# Altium project GARY_MIDI_CV_Converter.PrjPcb
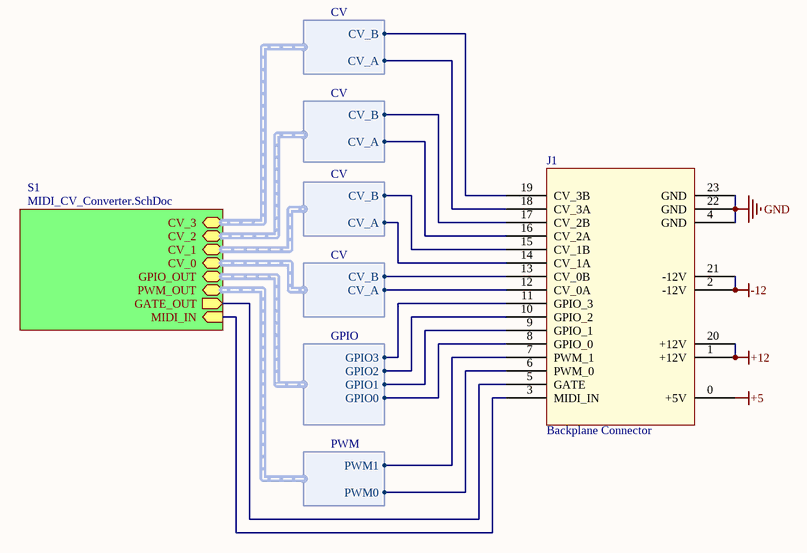
[diagram p0: Top Sheet.SchDoc]
4 sheets, 87 parts. Net scope: hierarchical (ports join the sheet entries above them; power ports are global).
Board file: GARY_MIDI_CV_Converter.PcbDoc
Sheets:
  Top Sheet.SchDoc
    S1 = MIDI_CV_Converter.SchDoc
      Current Buffer = CV_GATE_Current_Buffer.SchDoc
      Digital-Analog Converter_0 = DAC.SchDoc
      Digital-Analog Converter_1 = DAC.SchDoc
      Digital-Analog Converter_2 = DAC.SchDoc
      Digital-Analog Converter_3 = DAC.SchDoc

## Sheet Top Sheet.SchDoc: MIDI-CV Converter: Backplane Connector
size Letter; Engineer: Nicholas Morrow; DocumentNumber: 1; SheetNumber: 1; SheetTotal: 5; Project: GARY Synthesizer

### Parts
J1  Backplane Connector  [MIDI-CV CONVERTER MODULE]

### Sub-sheets
S1 = MIDI_CV_Converter.SchDoc: MIDI_IN (in), CV_0 (harness CV), CV_1 (harness CV), CV_2 (harness CV), CV_3 (harness CV), PWM_OUT (harness PWM), GPIO_OUT (harness GPIO), GATE_OUT (out)

### Harnesses
CV: CV_B, CV_A
PWM: PWM0, PWM1
GPIO: GPIO0, GPIO1, GPIO2, GPIO3

### Nets
+5: J1.0(+5V)
+12: J1.1(+12V) J1.20(+12V)
-12: J1.2(-12V) J1.21(-12V)
GND: J1.4(GND) J1.22(GND) J1.23(GND)
NetD1_2: J1.12(CV_0A) ; sheet S1/CV_0.CV_A
NetD2_2: J1.13(CV_0B) ; sheet S1/CV_0.CV_B
NetD3#2_2: J1.14(CV_1A) ; sheet S1/CV_1.CV_A
NetD4_2: J1.15(CV_1B) ; sheet S1/CV_1.CV_B
NetD5_2: J1.16(CV_2A) ; sheet S1/CV_2.CV_A
NetD6_2: J1.17(CV_2B) ; sheet S1/CV_2.CV_B
NetD7_2: J1.18(CV_3A) ; sheet S1/CV_3.CV_A
NetD8_2: J1.19(CV_3B) ; sheet S1/CV_3.CV_B
NetJ1_3: J1.3(MIDI_IN) ; sheet S1/MIDI_IN
NetJ1_5: J1.5(GATE) ; sheet S1/GATE_OUT
NetJ1_6: J1.6(PWM_0) ; sheet S1/PWM_OUT.PWM0
NetJ1_7: J1.7(PWM_1) ; sheet S1/PWM_OUT.PWM1
NetJ1_8: J1.8(GPIO_0) ; sheet S1/GPIO_OUT.GPIO0
NetJ1_9: J1.9(GPIO_1) ; sheet S1/GPIO_OUT.GPIO1
NetJ1_10: J1.10(GPIO_2) ; sheet S1/GPIO_OUT.GPIO2
NetJ1_11: J1.11(GPIO_3) ; sheet S1/GPIO_OUT.GPIO3

### Notes on the sheet
- Notes:
- Title:
- Size:
- Project:
- Letter
- Number:
- Revision:
- Date:
- Engineer:
- Sheet:
- of

### Library data of the parts
J1 = MIDI_CV_Converter

## Sheet MIDI_CV_Converter.SchDoc: MIDI-CV Converter
size Letter; DrawnBy: Nicholas Morrow; Engineer: Nicholas Morrow; Organization: Nicholas Morrow; Address1: UC Santa Barbara; Address2: Physics 127AL; Address3: Spring 2015; DocumentNumber: 4; Revision: a; SheetNumber: 4; SheetTotal: 5; Project: GARY Synthesizer
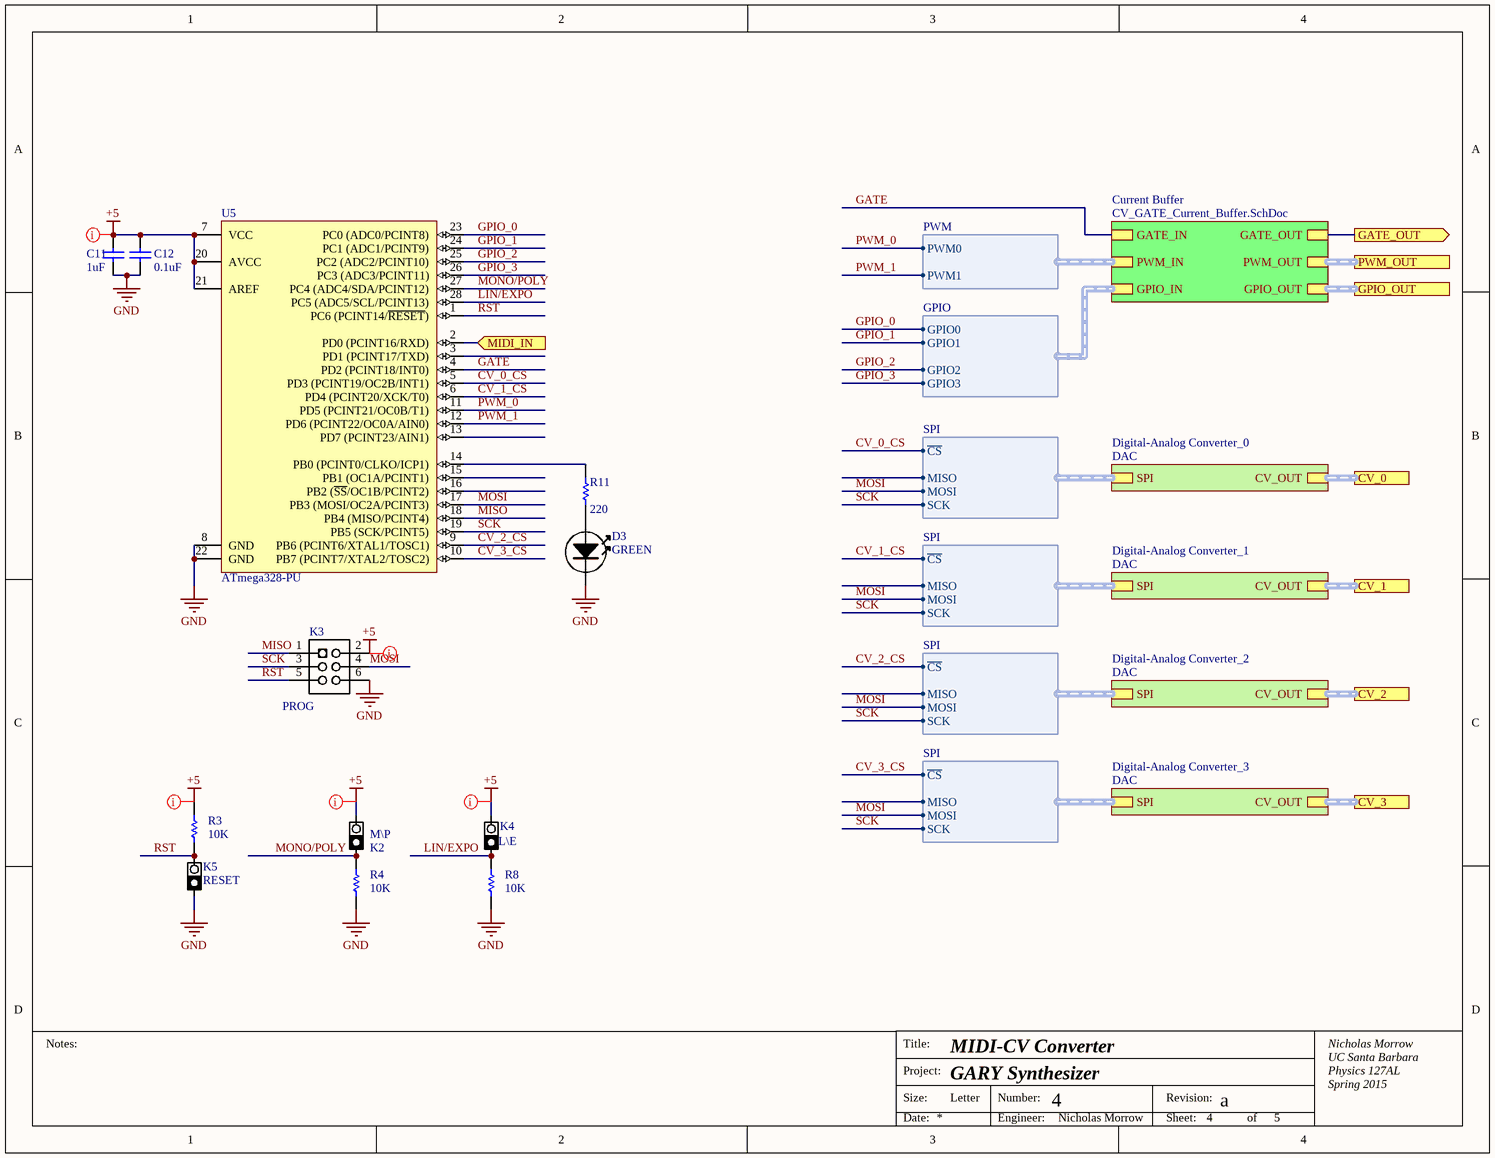
[diagram p1: MIDI_CV_Converter.SchDoc]

### Parts
(Parts that share a designator on the sheet are numbered #1, #2 ... from top to bottom, then left to right.)
C11#1  value 1uF  [CAP 5X11]  (hidden comment: Cap)
C12#1  value 0.1uF  [CAP 5X11]  (hidden comment: Cap)
D3#1  GREEN  [LED-5MM-GREEN]
K2#1  M\P  [JMPR2]
K3#1  PROG  [HEADER-2X3]
K4#1  L\E  [JMPR2]
K5  RESET  [JMPR2]
R3#1  value 10K  [AXIAL-0.3]
R4#1  value 10K  [AXIAL-0.3]
R8#1  value 10K  [AXIAL-0.3]
R11#1  value 220  [AXIAL-0.3]
U5#1  ATmega328-PU  [28P3]

### Sub-sheets
Current Buffer = CV_GATE_Current_Buffer.SchDoc: GATE_IN, PWM_IN (harness PWM), GPIO_IN (harness GPIO), GATE_OUT, PWM_OUT (harness PWM), GPIO_OUT (harness GPIO)
Digital-Analog Converter_0 = DAC: CV_OUT (harness CV), SPI (harness SPI)
Digital-Analog Converter_1 = DAC: CV_OUT (harness CV), SPI (harness SPI)
Digital-Analog Converter_2 = DAC: CV_OUT (harness CV), SPI (harness SPI)
Digital-Analog Converter_3 = DAC: CV_OUT (harness CV), SPI (harness SPI)

### Ports
CV_0 (harness CV), CV_1 (harness CV), CV_2 (harness CV), CV_3 (harness CV), GATE_OUT (out), GPIO_OUT (harness GPIO), MIDI_IN (in), PWM_OUT (harness PWM)

### Harnesses
PWM: PWM0, PWM1
GPIO: GPIO0, GPIO1, GPIO2, GPIO3
SPI: MISO, MOSI, SCK, ~{CS}

### Nets
+5: C11#1.2 C12#1.2 K2#1.2 K3#1.2 K4#1.2 R3#1.2 U5#1.7(VCC) U5#1.20(AVCC) U5#1.21(AREF)
GND: C11#1.1 C12#1.1 D3#1.K K3#1.6 K5.1 R4#1.1 R8#1.1 U5#1.8(GND) U5#1.22(GND)
CV_0_CS: U5#1.5(PD3_(PCINT19/OC2B/INT1)) ; sheet Digital-Analog Converter_0/SPI.~{CS}  [project net CHIP_SEL]
CV_1_CS: U5#1.6(PD4_(PCINT20/XCK/T0)) ; sheet Digital-Analog Converter_1/SPI.~{CS}  [project net CHIP_SEL]
CV_2_CS: U5#1.9(PB6_(PCINT6/XTAL1/TOSC1)) ; sheet Digital-Analog Converter_2/SPI.~{CS}  [project net CHIP_SEL]
CV_3_CS: U5#1.10(PB7_(PCINT7/XTAL2/TOSC2)) ; sheet Digital-Analog Converter_3/SPI.~{CS}  [project net CHIP_SEL]
GATE: U5#1.4(PD2_(PCINT18/INT0)) ; sheet Current Buffer/GATE_IN
GPIO_0: U5#1.23(PC0_(ADC0/PCINT8)) ; sheet Current Buffer/GPIO_IN.GPIO0
GPIO_1: U5#1.24(PC1_(ADC1/PCINT9)) ; sheet Current Buffer/GPIO_IN.GPIO1
GPIO_2: U5#1.25(PC2_(ADC2/PCINT10)) ; sheet Current Buffer/GPIO_IN.GPIO2
GPIO_3: U5#1.26(PC3_(ADC3/PCINT11)) ; sheet Current Buffer/GPIO_IN.GPIO3
LIN/EXPO: K4#1.1 R8#1.2 U5#1.28(PC5_(ADC5/SCL/PCINT13))
MISO: K3#1.1 U5#1.18(PB4_(MISO/PCINT4))
MONO/POLY: K2#1.1 R4#1.2 U5#1.27(PC4_(ADC4/SDA/PCINT12))
MOSI: K3#1.4 U5#1.17(PB3_(MOSI/OC2A/PCINT3)) ; sheet Digital-Analog Converter_0/SPI.MOSI, sheet Digital-Analog Converter_1/SPI.MOSI, sheet Digital-Analog Converter_2/SPI.MOSI, sheet Digital-Analog Converter_3/SPI.MOSI
PWM_0: U5#1.11(PD5_(PCINT21/OC0B/T1)) ; sheet Current Buffer/PWM_IN.PWM0
PWM_1: U5#1.12(PD6_(PCINT22/OC0A/AIN0)) ; sheet Current Buffer/PWM_IN.PWM1
RST: K3#1.5 K5.2 R3#1.1 U5#1.1(PC6_(PCINT14/~{RESET}))
SCK: K3#1.3 U5#1.19(PB5_(SCK/PCINT5)) ; sheet Digital-Analog Converter_0/SPI.SCK, sheet Digital-Analog Converter_1/SPI.SCK, sheet Digital-Analog Converter_2/SPI.SCK, sheet Digital-Analog Converter_3/SPI.SCK
NetD3#1_A: D3#1.A R11#1.1
NetJ1_3: U5#1.2(PD0_(PCINT16/RXD)) ; port MIDI_IN
NetJ1_5: port GATE_OUT, sheet Current Buffer/GATE_OUT
NetR11#1_2: R11#1.2 U5#1.14(PB0_(PCINT0/CLKO/ICP1))

Not connected (* = marked no-connect by the designer): U5#1 3(PD1_(PCINT17/TXD)) 13(PD7_(PCINT23/AIN1)) 15(PB1_(OC1A/PCINT1)) 16(PB2_(~{SS}/OC1B/PCINT2))

### Buses and harness runs
harness port CV_0 = sheet Digital-Analog Converter_0/CV_OUT
harness port CV_1 = sheet Digital-Analog Converter_1/CV_OUT
harness port CV_2 = sheet Digital-Analog Converter_2/CV_OUT
harness port CV_3 = sheet Digital-Analog Converter_3/CV_OUT
harness port GPIO_OUT = sheet Current Buffer/GPIO_OUT
harness port PWM_OUT = sheet Current Buffer/PWM_OUT

### Layout directives
net class Power: +5

### Notes on the sheet
- Notes:
- Title:
- Size:
- Project:
- Letter
- Number:
- Revision:
- Date:
- Engineer:
- Sheet:
- of

### Library data of the parts
C11#1 C12#1 = Cap: Capacitor; Published: 8-Jun-2000; LatestRevisionDate: 17-Jul-2002; LatestRevisionNote: Re-released for DXP Platform.; PackageReference: RAD-0.3; Publisher: Altium Limited; PackageDescription: Radial Cap, Thru-Hole; 2 Leads; 0.3 in Pin Spacing
D3#1 = LED-GREEN-5MM
K2#1 K4#1 K5 = JMPR2: JMPR2 OPEN BY DEFAULT; Manufacturer: Sullins Connector Solutions; Manufacturer Part Number: PBC36SAAN; Supplier 1: Digi-Key; Supplier Part Number 1: S1011E-36-ND; Reel: Open
K3#1 = HEADER-2X3
R3#1 R4#1 R8#1 R11#1 = Res1: Resistor; Published: 8-Jun-2000; LatestRevisionDate: 17-Jul-2002; LatestRevisionNote: Re-released for DXP Platform.; PackageReference: AXIAL-0.3; Publisher: Altium Limited; PackageDescription: Axial Device, Thru-Hole; 2 Leads; 0.3 in Pin Spacing
U5#1 = ATmega328-PU: 8-bit AVR Microcontroller, 32KB Flash, 1KB EEPROM, 2KB SRAM, 28-pin PDIP, Industrial Grade (-40°C to 85°C); Published: 1-Apr-2010; DatasheetVersion: revA, Jan-2010; PackageVersion: revB, Sep-2001; PackageReference: 28P3; Publisher: Altium Limited; PackageDescription: 28-lead (0.300"/7.62mm Wide) Plastic Dual Inline Package (PDIP); Supplier 1: Digi-Key; Supplier Part Number 1: ATMEGA328-PU-ND; Supplier 2: Mouser; Supplier Part Number 2: 556-ATMEGA328-PU; ComponentLink1Description: Manufacturer Link; ComponentLink1URL: http://www.atmel.com/products/avr/default.asp?; ComponentLink2Description: ATmega48A/48PA/88A/88PA/168A/168PA/328/328P Datasheet; ComponentLink2URL: http://www.atmel.com/dyn/resources/prod_documents/8271.pdf; ComponentLink3Description: ATmega48A/48PA/88A/88PA/168A/168PA/328/328P Summary; ComponentLink3URL: http://www.atmel.com/dyn/resources/prod_documents/8271S.pdf; ComponentLink4Description: Atmel.com Home; ComponentLink4URL: http://www.atmel.com

## Sheet CV_GATE_Current_Buffer.SchDoc: MIDI-CV Converter: GPIO Buffers
size Letter; Engineer: Nicholas Morrow; DocumentNumber: 2; SheetNumber: 2; SheetTotal: 5; Project: GARY Synthesizer
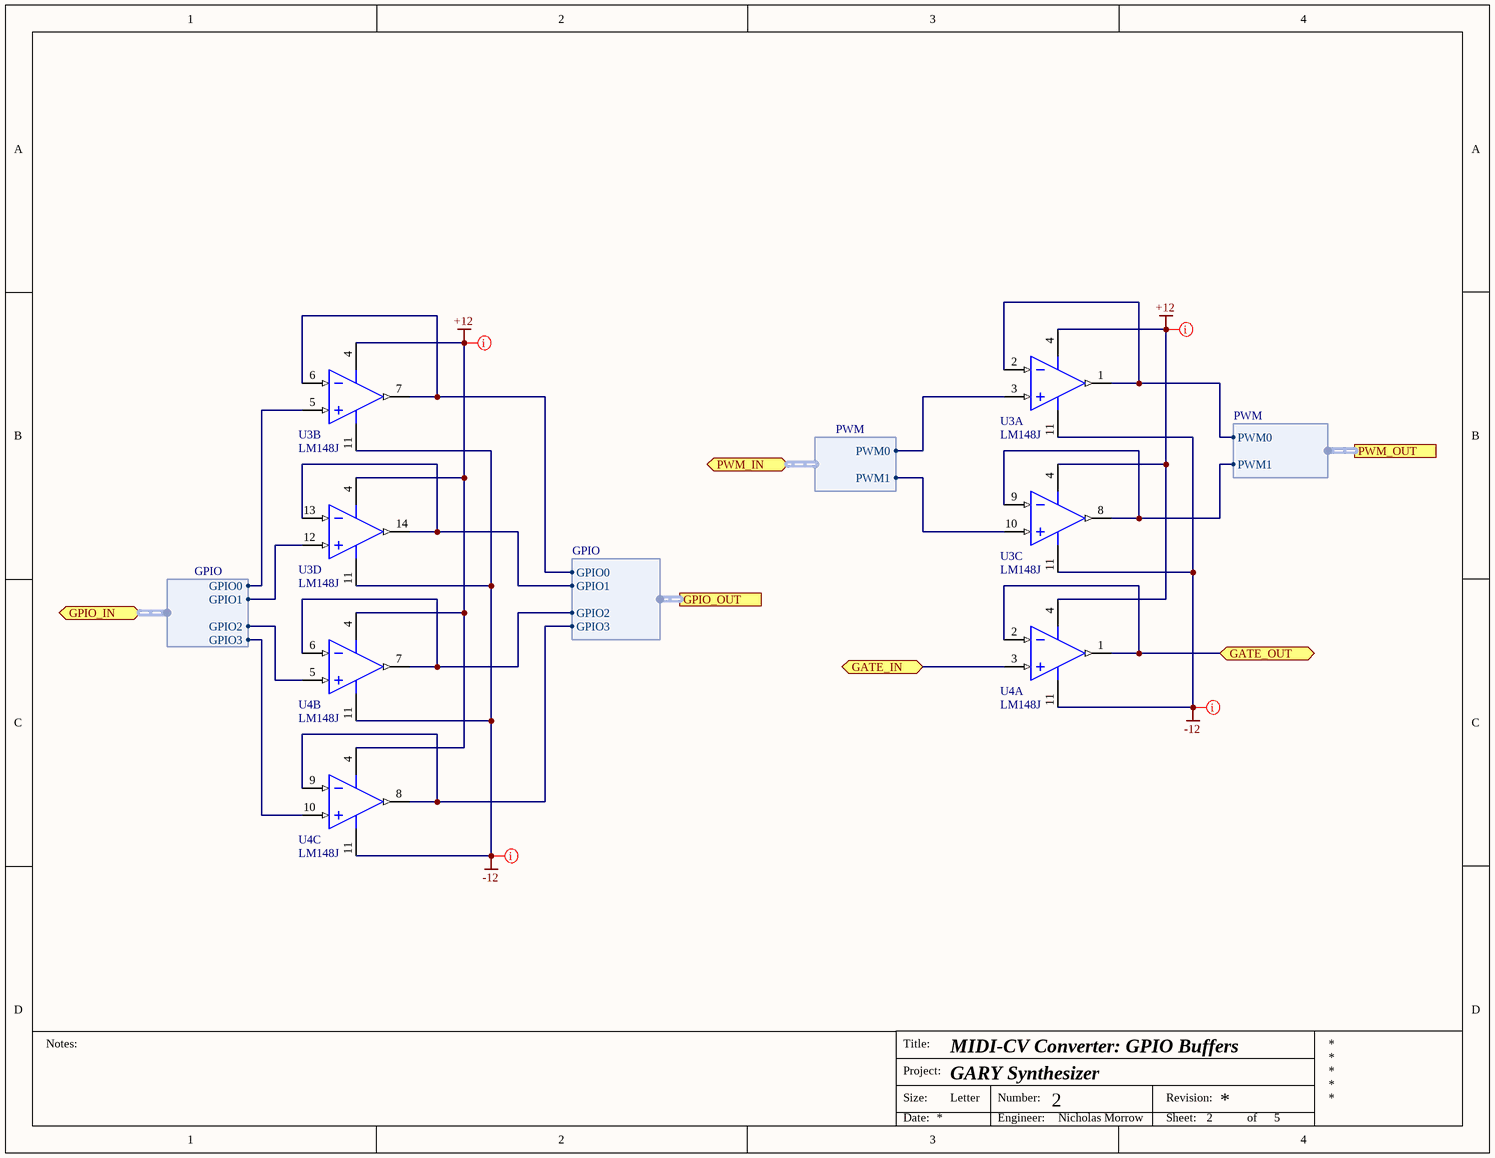
[diagram p2: CV_GATE_Current_Buffer.SchDoc]

### Parts
(Parts that share a designator on the sheet are numbered #1, #2 ... from top to bottom, then left to right.)
U3#1  LM148J  [J14A]  (parts A,B,C,D of 4)
U4#1  LM148J  [J14A]  (parts A,B,C of 4)

### Ports
GATE_IN, GATE_OUT, GPIO_IN (harness GPIO), GPIO_OUT (harness GPIO), PWM_IN (harness PWM), PWM_OUT (harness PWM)

### Harnesses
PWM: PWM0, PWM1
GPIO: GPIO0, GPIO1, GPIO2, GPIO3

### Nets
+12: U3#1.4(V+) U4#1.4(V+)
-12: U3#1.11(V-) U4#1.11(V-)
GATE: U4#1.3(IN1+) ; port GATE_IN
GPIO_0: U3#1.5(IN2+) ; port GPIO_IN.GPIO0
GPIO_1: U3#1.12(IN4+) ; port GPIO_IN.GPIO1
GPIO_2: U4#1.5(IN2+) ; port GPIO_IN.GPIO2
GPIO_3: U4#1.10(IN3+) ; port GPIO_IN.GPIO3
PWM_0: U3#1.3(IN1+) ; port PWM_IN.PWM0
PWM_1: U3#1.10(IN3+) ; port PWM_IN.PWM1
NetJ1_5: U4#1.1(OUT1) U4#1.2(IN1-) ; port GATE_OUT
NetJ1_6: U3#1.1(OUT1) U3#1.2(IN1-) ; port PWM_OUT.PWM0
NetJ1_7: U3#1.8(OUT3) U3#1.9(IN3-) ; port PWM_OUT.PWM1
NetJ1_8: U3#1.6(IN2-) U3#1.7(OUT2) ; port GPIO_OUT.GPIO0
NetJ1_9: U3#1.13(IN4-) U3#1.14(OUT4) ; port GPIO_OUT.GPIO1
NetJ1_10: U4#1.6(IN2-) U4#1.7(OUT2) ; port GPIO_OUT.GPIO2
NetJ1_11: U4#1.8(OUT3) U4#1.9(IN3-) ; port GPIO_OUT.GPIO3

### Layout directives
net class Power: +12, -12

### Notes on the sheet
- Notes:
- Title:
- Size:
- Project:
- Letter
- Number:
- Revision:
- Date:
- Engineer:
- Sheet:
- of

### Library data of the parts
U3#1 U4#1 = LM148J: Series Quad 741 Op Amp, 14-pin CerDIP; Manufacturer: National Semiconductor; PackageTopMarking: NSUZXYYTT*LM148J; PowerWise: N; CompType: Amplifiers; High-Reliability: Y; DatasheetVersion: Nov-2003; PackageVersion: revJ, Jul-2002; PackageReference: J14A; PackageDescription: Cerdip, .400 x .310in Body, 14 Lead, .300in Centers, .100in Pitch; PartNumber: LM148J; RoHS: N; PinCount: 14; ComponentLink1Description: Manufacturer URL; ComponentLink1URL: http://www.national.com/; ComponentLink2Description: LM148 Datasheet; ComponentLink2URL: http://www.national.com/ds/LM/LM148.pdf; ComponentLink3Description: LM148 Web Page; ComponentLink3URL: http://www.national.com/pf/LM/LM148.html; ComponentLink4Description: J14A Package Page; ComponentLink4URL: http://www.national.com/packaging/folders/j14a.html

## Sheet DAC.SchDoc: MIDI-CV Converter: D-A Converter
size Letter; Engineer: Nicholas Morrow; DocumentNumber: 3; SheetNumber: 3; SheetTotal: 5; Project: GARY Synthesizer
Used 4 times, as channels S1/Digital-Analog Converter_0, S1/Digital-Analog Converter_1, S1/Digital-Analog Converter_2, S1/Digital-Analog Converter_3. Parts and nets are listed once, with the designators drawn on the sheet.
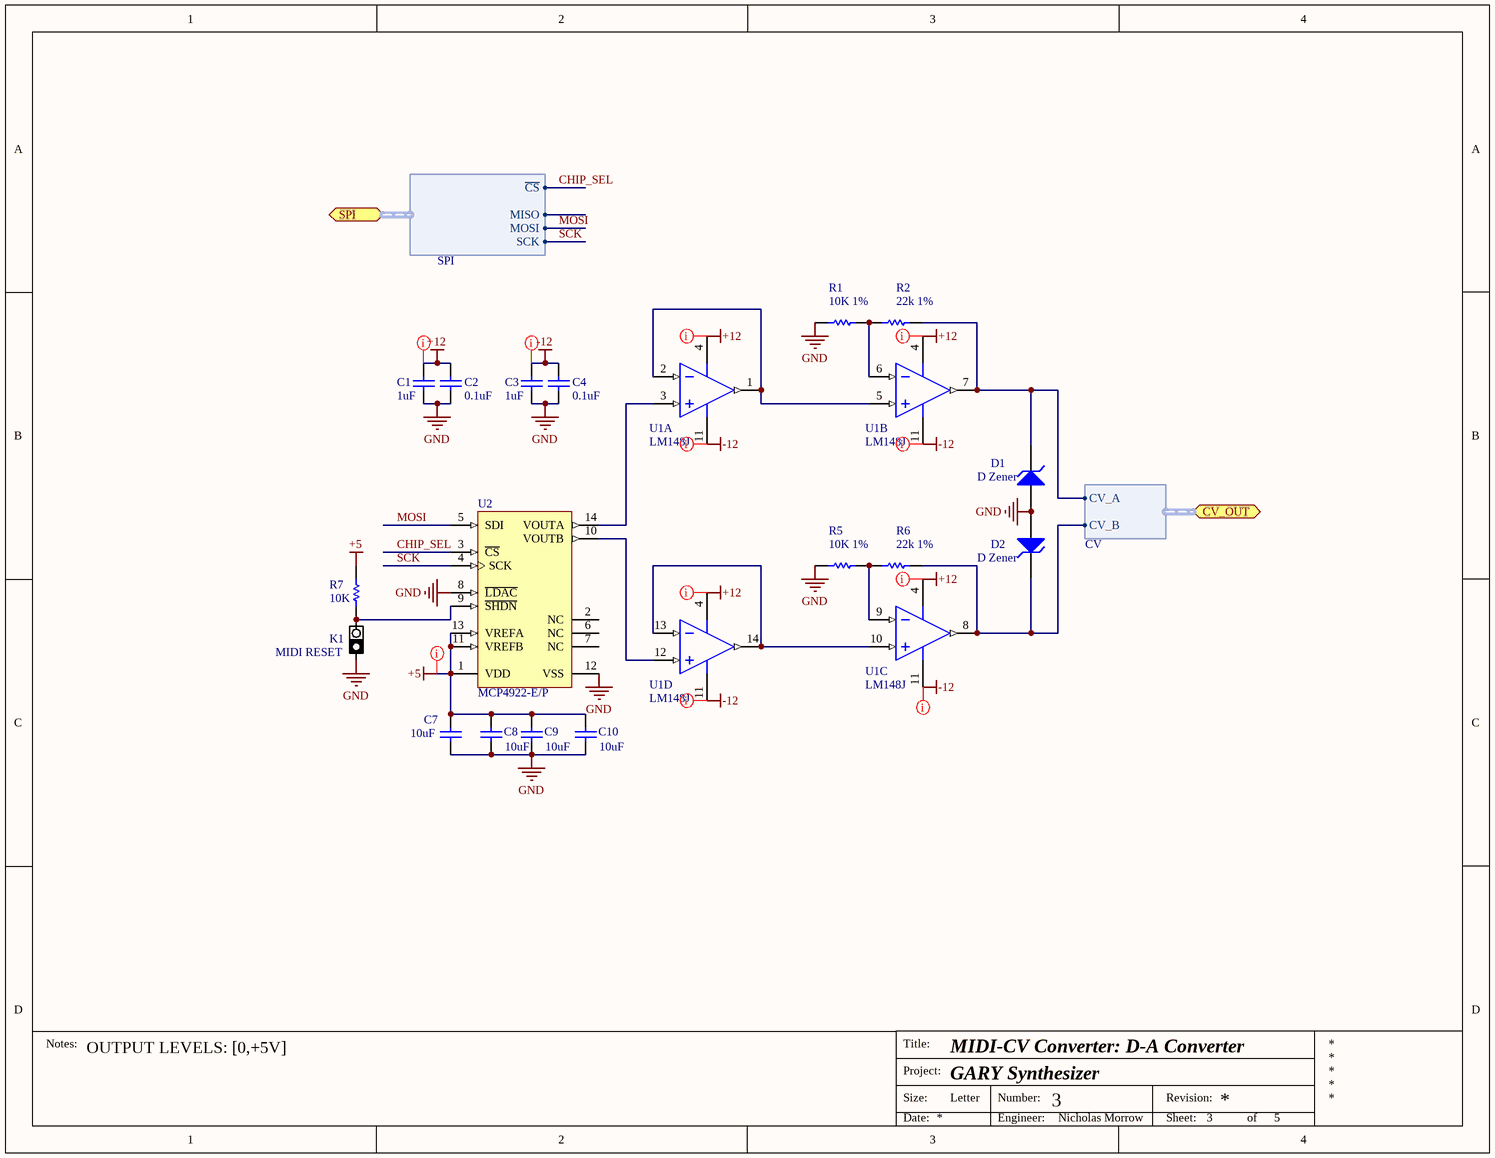
[diagram p3: DAC.SchDoc]

### Parts
C1  value 1uF  [CAP 5X11]  (hidden comment: Cap)
C2  value 0.1uF  [CAP 5X11]  (hidden comment: Cap)
C3  value 1uF  [CAP 5X11]  (hidden comment: Cap)
C4  value 0.1uF  [CAP 5X11]  (hidden comment: Cap)
C7  value 10uF  [CAP 5X11]  (hidden comment: Cap)
C8  value 10uF  [CAP 5X11]  (hidden comment: Cap)
C9  value 10uF  [CAP 5X11]  (hidden comment: Cap)
C10  value 10uF  [CAP 5X11]  (hidden comment: Cap)
D1  D Zener  [DIODE-0.4]
D2  D Zener  [DIODE-0.4]
K1  MIDI RESET  [JMPR2]
R1  value 10K 1%  [AXIAL-0.3]
R2  value 22k 1%  [AXIAL-0.3]
R5  value 10K 1%  [AXIAL-0.3]
R6  value 22k 1%  [AXIAL-0.3]
R7  value 10K  [AXIAL-0.3]
U1  LM148J  [J14A]  (parts A,B,C,D of 4)
U2  MCP4922-E/P  [PDIP300-P14]

### Ports
CV_OUT (harness CV), SPI (harness SPI)

### Harnesses
CV: CV_A, CV_B
SPI: MISO, MOSI, SCK, ~{CS}

### Nets
+5: C7.2 C8.2 C9.2 C10.2 R7.2 U2.1(VDD) U2.11(VREFB) U2.13(VREFA)
+12: C1.2 C2.2 U1.4(V+)
-12: C3.2 C4.2 U1.11(V-)
GND: C1.1 C2.1 C3.1 C4.1 C7.1 C8.1 C9.1 C10.1 D1.1(A) D2.1(A) K1.1 R1.2 R5.2 U2.8(~{LDAC}) U2.12(VSS)
CHIP_SEL: U2.3(~{CS}) ; port SPI.~{CS}
MOSI: U2.5(SDI) ; port SPI.MOSI
SCK: U2.4(SCK) ; port SPI.SCK
NetD1_2: D1.2(K) R2.1 U1.7(OUT2) ; port CV_OUT.CV_A
NetD2_2: D2.2(K) R6.1 U1.8(OUT3) ; port CV_OUT.CV_B
NetK1_2: K1.2 R7.1 U2.9(~{SHDN})
NetR1_1: R1.1 R2.2 U1.6(IN2-)
NetR5_1: R5.1 R6.2 U1.9(IN3-)
NetU1_1: U1.1(OUT1) U1.2(IN1-) U1.5(IN2+)
NetU1_3: U1.3(IN1+) U2.14(VOUTA)
NetU1_10: U1.10(IN3+) U1.13(IN4-) U1.14(OUT4)
NetU1_12: U1.12(IN4+) U2.10(VOUTB)

Not connected (* = marked no-connect by the designer): U2 2(NC) 6(NC) 7(NC)

### Channels
S1/Digital-Analog Converter_0: designators C1=C1 C2=C2 C3=C3 C4=C4 C7=C5 C8=C6 C9=C7 C10=C8 D1=D1 D2=D2 K1=K1 R1=R1 R2=R2 R5=R3#2 R6=R4#2 R7=R5 U1=U3#2 U2=U4#2
S1/Digital-Analog Converter_1: designators C1=C9 C2=C10 C3=C11#2 C4=C12#2 C7=C13 C8=C14 C9=C15 C10=C16 D1=D3#2 D2=D4 K1=K2#2 R1=R6 R2=R7 R5=R8#2 R6=R9 R7=R10 U1=U5#2 U2=U6
S1/Digital-Analog Converter_2: designators C1=C17 C2=C18 C3=C19 C4=C20 C7=C21 C8=C22 C9=C23 C10=C24 D1=D5 D2=D6 K1=K3#2 R1=R11#2 R2=R12 R5=R13 R6=R14 R7=R15 U1=U7 U2=U8
S1/Digital-Analog Converter_3: designators C1=C25 C2=C26 C3=C27 C4=C28 C7=C29 C8=C30 C9=C31 C10=C32 D1=D7 D2=D8 K1=K4#2 R1=R16 R2=R17 R5=R18 R6=R19 R7=R20 U1=U9 U2=U10

### Layout directives
net class Power: +5, +12, -12

### Notes on the sheet
- OUTPUT LEVELS: [0,+5V]
- Notes:
- Title:
- Size:
- Project:
- Letter
- Number:
- Revision:
- Date:
- Engineer:
- Sheet:
- of

### Library data of the parts
C1-C4 C7-C10 = Cap: Capacitor; Published: 8-Jun-2000; LatestRevisionDate: 17-Jul-2002; LatestRevisionNote: Re-released for DXP Platform.; PackageReference: RAD-0.3; Publisher: Altium Limited; PackageDescription: Radial Cap, Thru-Hole; 2 Leads; 0.3 in Pin Spacing
D1 D2 = D Zener: Zener Diode; Manufacturer: NXP Semiconductors; Manufacturer Part Number: NZX3V0C,133; Voltage - Zener (Nom) (Vz): 3V; Tolerance: ±3%; Power - Max: 500mW; Impedance (Max) (Zzt): 100 Ohm; Current - Reverse Leakage @ Vr: 10µA @ 1V; Voltage - Forward (Vf) (Max) @ If: 1.5V @ 200mA; Published: 8-Jun-2000; LatestRevisionDate: 17-Jul-2002; LatestRevisionNote: Re-released for DXP Platform.; PackageReference: DIODE-0.7; Publisher: Altium Limited; PackageDescription: Diode, Thru-Hole; 2 Leads; 0.7 in Pin Spacing; Supplier 1: Digi-Key; RoHS: RoHS non-compliant; Category: Discrete Semiconductor Products; Stock 1: 16581; Pricing 1: 1=0.21, 10=0.191, 25=0.174, 100=0.1251, 250=0.07372, 500=0.06116, 1000=0.04172, 2500=0.0355 (USD); Packaging: Cut Tape (CT); Operating Temperature: -55°C ~ 175°C; Mounting Type: Through Hole; Package / Case: DO-204AH, DO-35, Axial; Supplier Device Package: ALF2; ComponentLink1URL: http://www.nxp.com/documents/data_sheet/NZX_SER.pdf; ComponentLink1Description: http://www.nxp.com/documents/data_sheet/NZX_SER.pdf
K1 = JMPR2: as K2#1 on sheet MIDI_CV_Converter; Supplier 1: Digi-Key; Supplier Part Number 1: S1011E-36-ND; Reel: Open
R1 R2 R5-R7 = Res1: Resistor; Published: 8-Jun-2000; LatestRevisionDate: 17-Jul-2002; LatestRevisionNote: Re-released for DXP Platform.; PackageReference: AXIAL-0.3; Publisher: Altium Limited; PackageDescription: Axial Device, Thru-Hole; 2 Leads; 0.3 in Pin Spacing
U1 = LM148J: as U3#1 on sheet CV_GATE_Current_Buffer; DatasheetVersion: Nov-2003; PackageVersion: revJ, Jul-2002; PackageReference: J14A; PackageDescription: Cerdip, .400 x .310in Body, 14 Lead, .300in Centers, .100in Pitch; PartNumber: LM148J; RoHS: N; PinCount: 14; ComponentLink1Description: Manufacturer URL; ComponentLink1URL: http://www.national.com/; ComponentLink2Description: LM148 Datasheet; ComponentLink2URL: http://www.national.com/ds/LM/LM148.pdf; ComponentLink3Description: LM148 Web Page; ComponentLink3URL: http://www.national.com/pf/LM/LM148.html; ComponentLink4Description: J14A Package Page; ComponentLink4URL: http://www.national.com/packaging/folders/j14a.html
U2 = MCP4922-E/P: 12-Bit DAC with SPI Interface, 14-Pin PDIP, Extended Temperature; Manufacturer: Microchip; Settling Time: 4.5µs; Number of Bits: 12; Number of Converters: 2; Voltage Supply Source: Single Supply; Number of Outputs and Type: 2 Voltage, Unipolar; 2 Voltage, Bipolar; DatasheetVersion: revA, Apr-2010; PackageVersion: revBB, Aug-2009; PackageReference: PDIP300-P14; PackageDescription: 14-Lead Plastic Dual In-Line (P) - 300 mil Body [PDIP]; Supplier 1: Digi-Key; Supplier Part Number 1: MCP4922-E/P-ND; Supplier 2: Farnell; Supplier Part Number 2: 1292244; Supplier 3: Newark; Supplier Part Number 3: 61K2950; Supplier 4: Mouser; Supplier Part Number 4: 579-MCP4922-E/P; Mounting Technology: Through Hole; PartNumber: MCP4922-E/P; ComponentLink1Description: Manufacturer URL; ComponentLink1URL: http://www.microchip.com/; ComponentLink2Description: Datasheet; ComponentLink2URL: http://ww1.microchip.com/downloads/en/DeviceDoc/22250A.pdf; ComponentLink3Description: Package Specification; ComponentLink3URL: http://www.microchip.com/stellent/groups/techpub_sg/documents/packagingspec/en012702.pdf; Manufacturer Part Number: MCP4922-E/P; RoHS: RoHS Compliant; Category: Integrated Circuits (ICs); Stock 1: 1015; Pricing 1: 1=3.14, 10=2.62, 25=2.19, 100=1.99 (USD); Packaging: Tube; Data Interface: SPI; Operating Temperature: -40°C ~ 125°C; Mounting Type: Through Hole; Package / Case: 14-DIP (0.300", 7.62mm); Supplier Device Package: 14-PDIP; Sampling Rate (Per Second): *; ComponentLink4URL: http://www.microchip.com/mymicrochip/filehandler.aspx?ddocname=en547858; ComponentLink4Description: http://www.microchip.com/mymicrochip/filehandler.aspx?ddocname=en547858

## Nets that join several sheets
+5: Top Sheet (J1.0), MIDI_CV_Converter (9 pins), S1/Digital-Analog Converter_0 (8 pins), S1/Digital-Analog Converter_1 (8 pins), S1/Digital-Analog Converter_2 (8 pins), S1/Digital-Analog Converter_3 (8 pins)
+12: Top Sheet (J1.1 J1.20), CV_GATE_Current_Buffer (U3#1.4 U4#1.4), S1/Digital-Analog Converter_0 (C1.2 C2.2 U3#2.4), S1/Digital-Analog Converter_1 (C9.2 C10.2 U5#2.4), S1/Digital-Analog Converter_2 (C17.2 C18.2 U7.4), S1/Digital-Analog Converter_3 (C25.2 C26.2 U9.4)
-12: Top Sheet (J1.2 J1.21), CV_GATE_Current_Buffer (U3#1.11 U4#1.11), S1/Digital-Analog Converter_0 (C3.2 C4.2 U3#2.11), S1/Digital-Analog Converter_1 (C11#2.2 C12#2.2 U5#2.11), S1/Digital-Analog Converter_2 (C19.2 C20.2 U7.11), S1/Digital-Analog Converter_3 (C27.2 C28.2 U9.11)
GND: Top Sheet (J1.4 J1.22 J1.23), MIDI_CV_Converter (9 pins), S1/Digital-Analog Converter_0 (15 pins), S1/Digital-Analog Converter_1 (15 pins), S1/Digital-Analog Converter_2 (15 pins), S1/Digital-Analog Converter_3 (15 pins)
CHIP_SEL: MIDI_CV_Converter (U5#1.5), S1/Digital-Analog Converter_0 (U4#2.3)
CHIP_SEL: MIDI_CV_Converter (U5#1.6), S1/Digital-Analog Converter_1 (U6.3)
CHIP_SEL: MIDI_CV_Converter (U5#1.9), S1/Digital-Analog Converter_2 (U8.3)
CHIP_SEL: MIDI_CV_Converter (U5#1.10), S1/Digital-Analog Converter_3 (U10.3)
GATE: MIDI_CV_Converter (U5#1.4), CV_GATE_Current_Buffer (U4#1.3)
GPIO_0: MIDI_CV_Converter (U5#1.23), CV_GATE_Current_Buffer (U3#1.5)
GPIO_1: MIDI_CV_Converter (U5#1.24), CV_GATE_Current_Buffer (U3#1.12)
GPIO_2: MIDI_CV_Converter (U5#1.25), CV_GATE_Current_Buffer (U4#1.5)
GPIO_3: MIDI_CV_Converter (U5#1.26), CV_GATE_Current_Buffer (U4#1.10)
MOSI: MIDI_CV_Converter (K3#1.4 U5#1.17), S1/Digital-Analog Converter_0 (U4#2.5), S1/Digital-Analog Converter_1 (U6.5), S1/Digital-Analog Converter_2 (U8.5), S1/Digital-Analog Converter_3 (U10.5)
NetD1_2: Top Sheet (J1.12), S1/Digital-Analog Converter_0 (D1.2 R2.1 U3#2.7)
NetD2_2: Top Sheet (J1.13), S1/Digital-Analog Converter_0 (D2.2 R4#2.1 U3#2.8)
NetD3#2_2: Top Sheet (J1.14), S1/Digital-Analog Converter_1 (D3#2.2 R7.1 U5#2.7)
NetD4_2: Top Sheet (J1.15), S1/Digital-Analog Converter_1 (D4.2 R9.1 U5#2.8)
NetD5_2: Top Sheet (J1.16), S1/Digital-Analog Converter_2 (D5.2 R12.1 U7.7)
NetD6_2: Top Sheet (J1.17), S1/Digital-Analog Converter_2 (D6.2 R14.1 U7.8)
NetD7_2: Top Sheet (J1.18), S1/Digital-Analog Converter_3 (D7.2 R17.1 U9.7)
NetD8_2: Top Sheet (J1.19), S1/Digital-Analog Converter_3 (D8.2 R19.1 U9.8)
NetJ1_3: Top Sheet (J1.3), MIDI_CV_Converter (U5#1.2)
NetJ1_5: Top Sheet (J1.5), CV_GATE_Current_Buffer (U4#1.1 U4#1.2)
NetJ1_6: Top Sheet (J1.6), CV_GATE_Current_Buffer (U3#1.1 U3#1.2)
NetJ1_7: Top Sheet (J1.7), CV_GATE_Current_Buffer (U3#1.8 U3#1.9)
NetJ1_8: Top Sheet (J1.8), CV_GATE_Current_Buffer (U3#1.6 U3#1.7)
NetJ1_9: Top Sheet (J1.9), CV_GATE_Current_Buffer (U3#1.13 U3#1.14)
NetJ1_10: Top Sheet (J1.10), CV_GATE_Current_Buffer (U4#1.6 U4#1.7)
NetJ1_11: Top Sheet (J1.11), CV_GATE_Current_Buffer (U4#1.8 U4#1.9)
PWM_0: MIDI_CV_Converter (U5#1.11), CV_GATE_Current_Buffer (U3#1.3)
PWM_1: MIDI_CV_Converter (U5#1.12), CV_GATE_Current_Buffer (U3#1.10)
SCK: MIDI_CV_Converter (K3#1.3 U5#1.19), S1/Digital-Analog Converter_0 (U4#2.4), S1/Digital-Analog Converter_1 (U6.4), S1/Digital-Analog Converter_2 (U8.4), S1/Digital-Analog Converter_3 (U10.4)